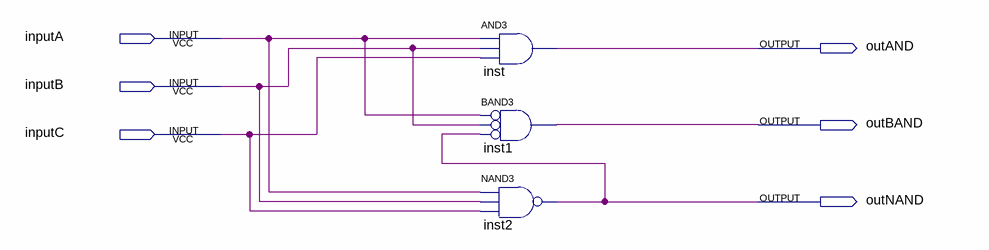
[diagram p0: schematic sheet]
// Quartus schematic testing.bdf as structural Verilog: 3 symbols, 6 pins
module testing (
  input  inputA,
  input  inputB,
  input  inputC,
  output outAND,
  output outBAND,
  output outNAND
);

  and inst (outAND, inputA, inputB, inputC);
  and inst1 (outBAND, ~inputA, ~inputB, ~outNAND);  // BAND3
  nand inst2 (outNAND, inputA, inputB, inputC);
endmodule
